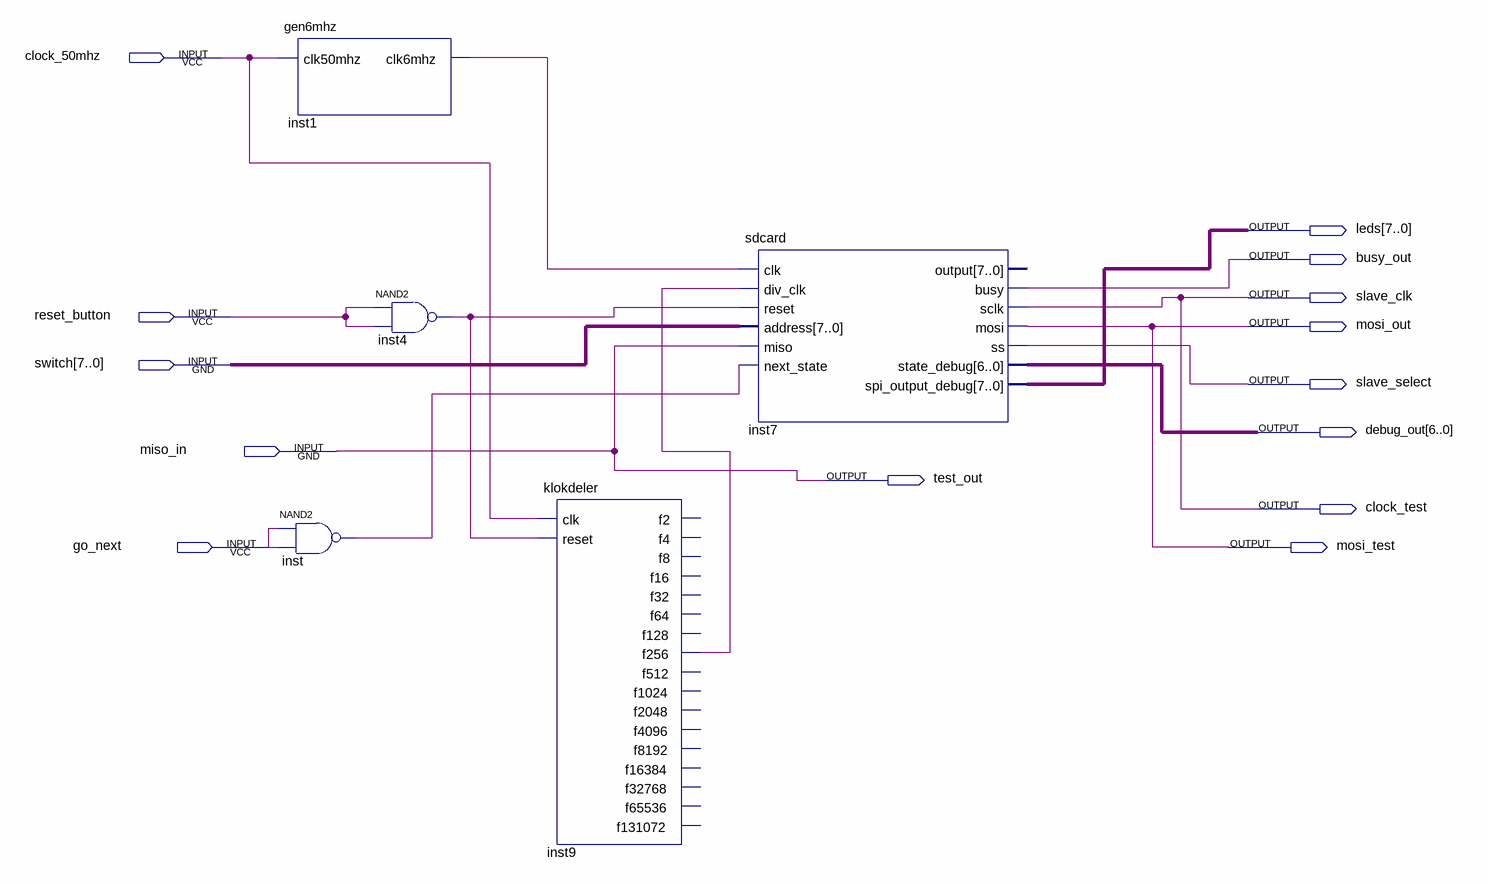
[diagram p0: schematic sheet]
// Quartus schematic top_de1.bdf as structural Verilog: 5 symbols, 14 pins
module top_de1 (
  input  clock_50mhz,
  input  reset_button,
  input  [7:0] switch,
  input  miso_in,
  input  go_next,
  output [7:0] leds,
  output busy_out,
  output slave_clk,
  output mosi_out,
  output slave_select,
  output [6:0] debug_out,
  output test_out,
  output clock_test,
  output mosi_test
);

  wire inst1_clk6mhz, inst4_out, inst9_f256, inst_out;

  gen6mhz inst1 (.clk50mhz(clock_50mhz), .clk6mhz(inst1_clk6mhz));
  nand inst (inst_out, go_next, go_next);
  nand inst4 (inst4_out, reset_button, reset_button);
  klokdeler inst9 (
    .clk(clock_50mhz), .reset(inst4_out), .f256(inst9_f256));  // open: f2, f4, f8, f16, f32, f64, f128, f512, f1024, f2048, f4096, f8192, f16384, f32768, f65536, f131072
  sdcard inst7 (
    .clk(inst1_clk6mhz), .div_clk(inst9_f256), .reset(inst4_out), .address(switch), .miso(miso_in),
    .next_state(inst_out), .busy(busy_out), .sclk(clock_test), .mosi(mosi_out), .ss(slave_select),
    .state_debug(debug_out), .spi_output_debug(leds));  // open: output

  assign mosi_test = mosi_out;
  assign slave_clk = clock_test;
  assign test_out = miso_in;
endmodule
